# Altium schematic sheet fpga_io.schdoc: FPGA IO
size 431 x 279 mm; DrawnBy: D. Bruey, M.Ciuffo; Organization: Synapse Product Development, LLC.; Address1: 1511 6th Ave., Suite 400; Address2: Seattle, Washington 98101; Address3: 206.381.0898; Address4: www.synapse.com; DocumentNumber: 5; SheetNumber: 3; SheetTotal: 10; PageSetup: Record=PageOptions|CenterHorizontal=True|CenterVertical=True|PrintScale=1.06|XCorrection=1.00|YCorrection=1.00|PrintKind=1|BorderSize=5000000|LeftOffset=0|BottomOffset=0|Orientation=2|PaperLength=4318|PaperWidth=2794|Scale=100|PaperSource=7|PrintQuality=200|MediaType=1|DitherType=10|PrintScaleMode=1|PaperKind=11x17|PaperIndex=3
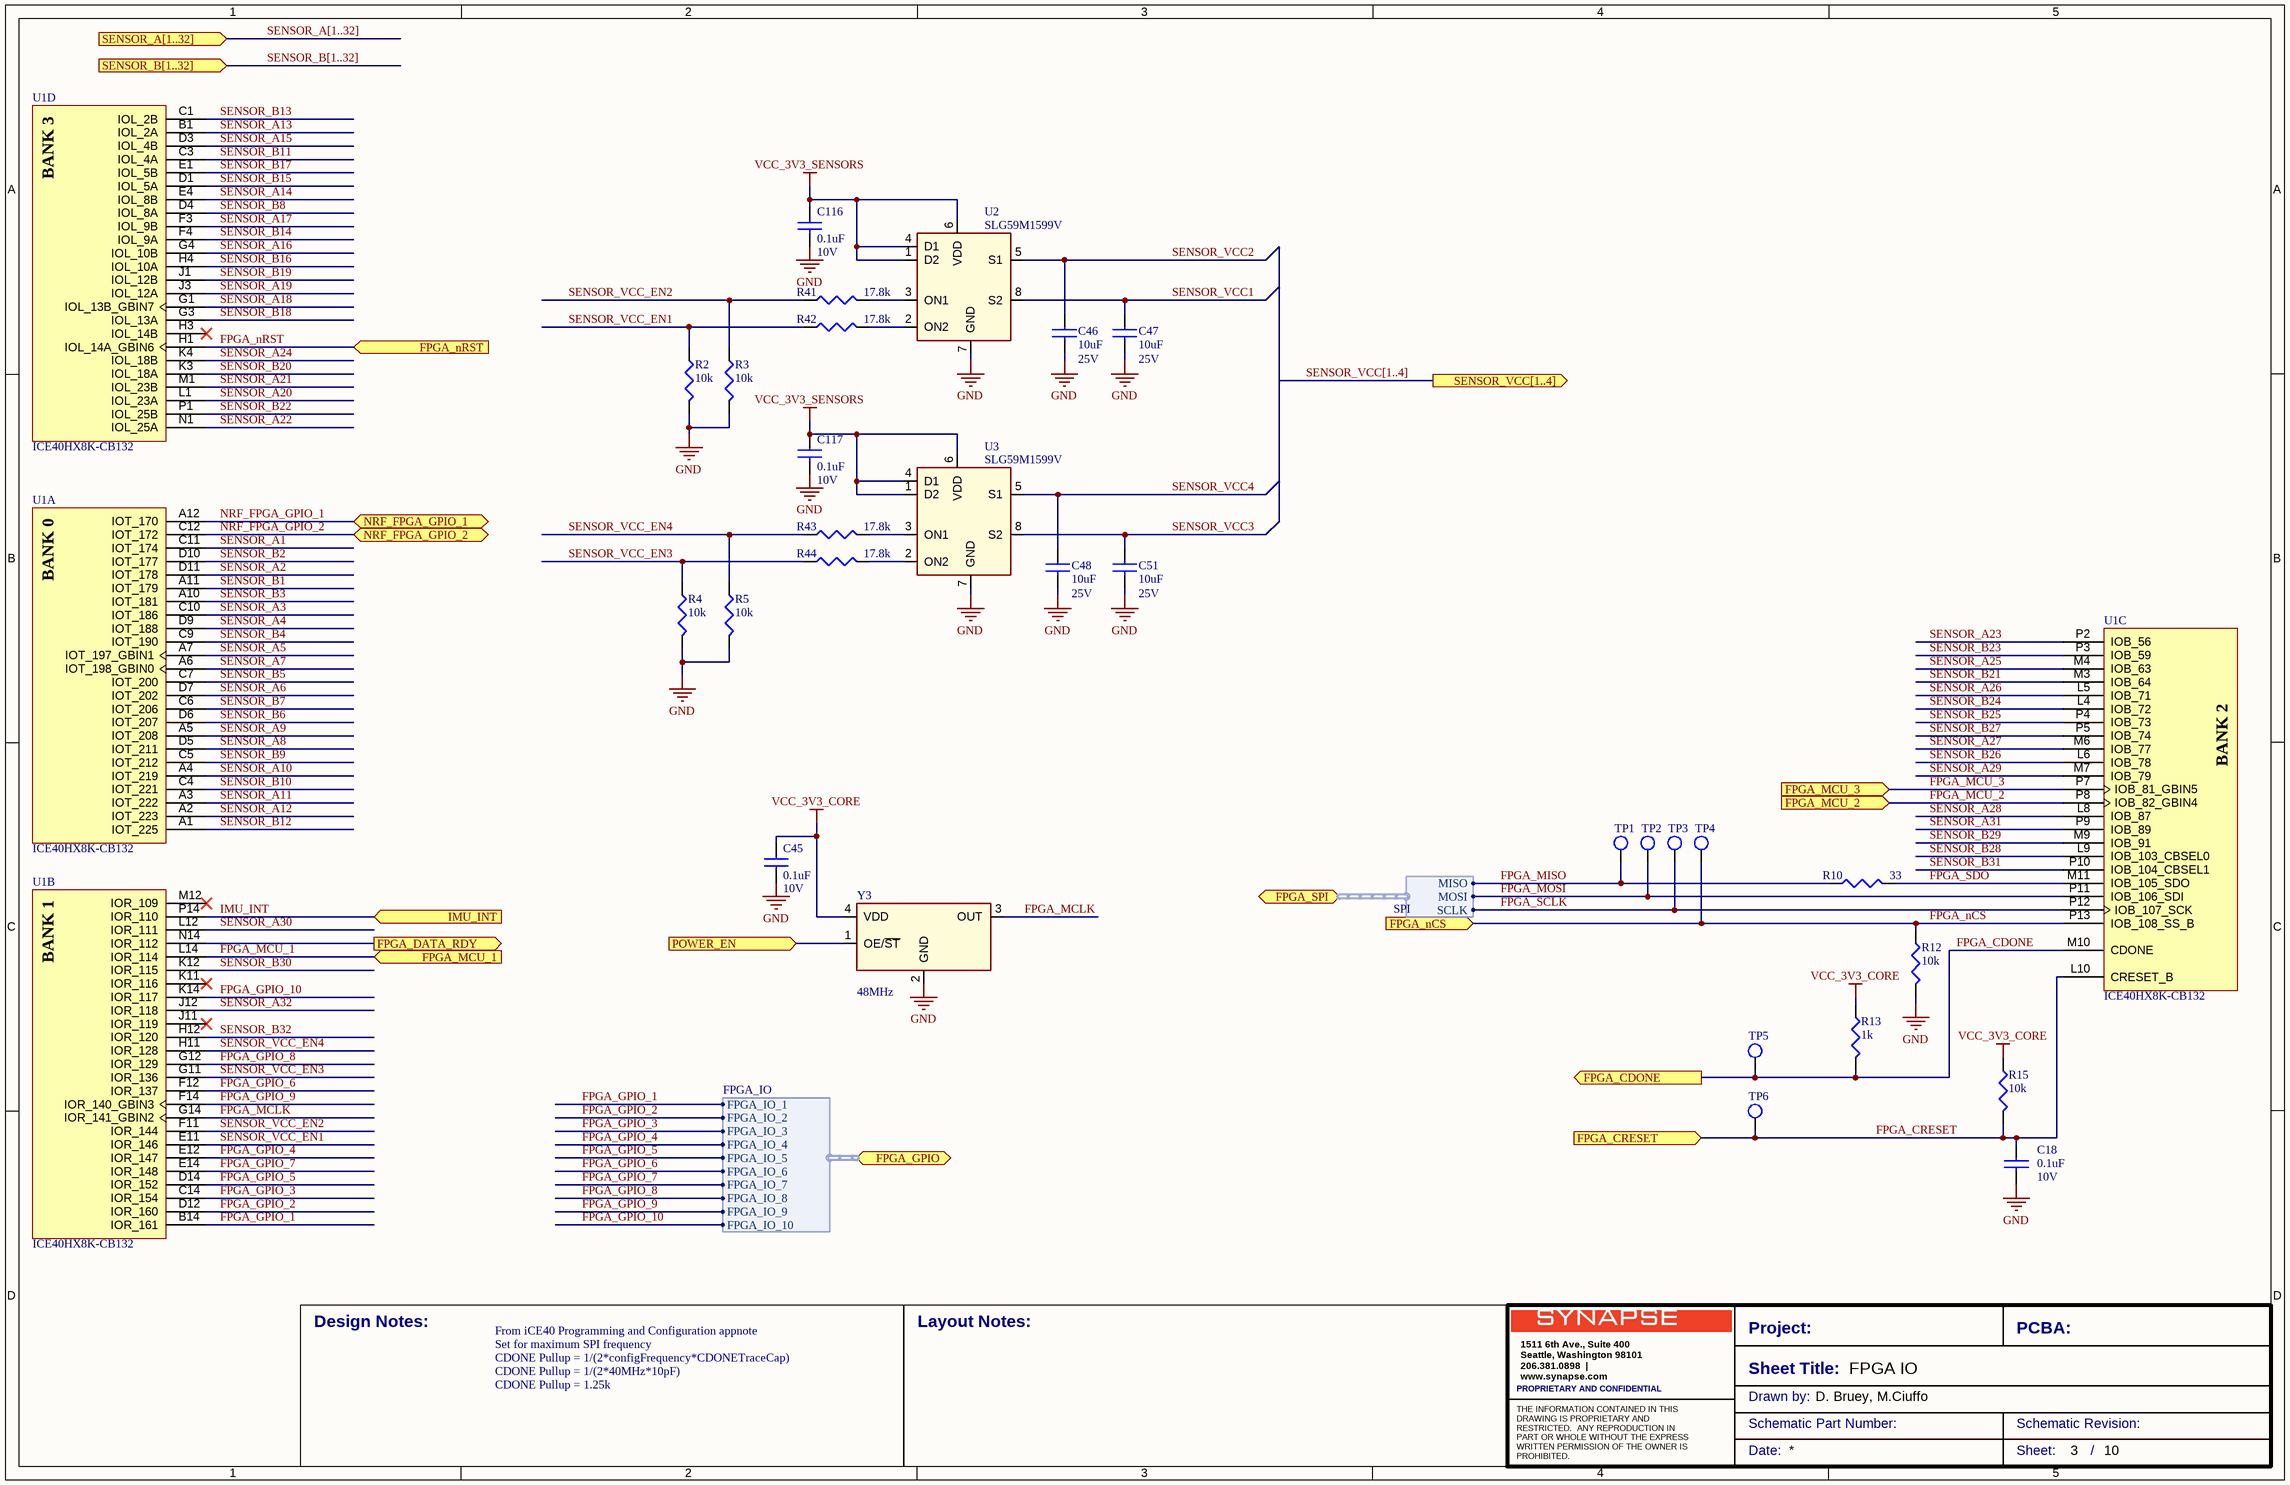
[diagram p0: fpga_io.schdoc]

## Parts
C18  0.1uF  Voltage: 10V  [0201-IPCsm_33]
C45  0.1uF  Voltage: 10V  [0201-IPCsm_33]
C46  10uF  Voltage: 25V  [0603-ipcsm_90]
C47  10uF  Voltage: 25V  [0603-ipcsm_90]
C48  10uF  Voltage: 25V  [0603-ipcsm_90]
C51  10uF  Voltage: 25V  [0603-ipcsm_90]
C116  0.1uF  Voltage: 10V  [0201-IPCsm_33]
C117  0.1uF  Voltage: 10V  [0201-IPCsm_33]
R2  10k  [0201-IPCsm_26]
R3  10k  [0201-IPCsm_26]
R4  10k  [0201-IPCsm_26]
R5  10k  [0201-IPCsm_26]
R10  33  [0201-IPCsm_26]
R12  10k  [0201-IPCsm_26]
R13  1k  [0201-IPCsm_26]
R15  10k  [0201-IPCsm_26]
R41  17.8k  [0201-IPCsm_26]
R42  17.8k  [0201-IPCsm_26]
R43  17.8k  [0201-IPCsm_26]
R44  17.8k  [0201-IPCsm_26]
TP1  tp-1mm  [TP-S100_SMT]  (value not drawn)  (no BOM)
TP2  tp-1mm  [TP-S100_SMT]  (value not drawn)  (no BOM)
TP3  tp-1mm  [TP-S100_SMT]  (value not drawn)  (no BOM)
TP4  tp-1mm  [TP-S100_SMT]  (value not drawn)  (no BOM)
TP5  tp-1mm  [TP-S100_SMT]  (value not drawn)  (no BOM)
TP6  tp-1mm  [TP-S100_SMT]  (value not drawn)  (no BOM)
U1  ICE40HX8K-CB132  [LATC-csBGA-132]  (parts A,B,C,D of 5)
U2  SLG59M1599V  [STDFN8_SLG59M1599V]
U3  SLG59M1599V  [STDFN8_SLG59M1599V]
Y3  48MHz  [XTAL_SiT1602_250x200x80]

## Ports
FPGA_CDONE (out), FPGA_CRESET (in), FPGA_DATA_RDY (out), FPGA_GPIO (harness FPGA_IO), FPGA_MCU_1 (in), FPGA_MCU_2 (in), FPGA_MCU_3 (in), FPGA_nCS (in), FPGA_nRST (in), FPGA_SPI (harness SPI), IMU_INT (in), NRF_FPGA_GPIO_1 (bidir), NRF_FPGA_GPIO_2 (bidir), POWER_EN (in), SENSOR_A[1..32] (in), SENSOR_B[1..32] (in), SENSOR_VCC[1..4] (out)

## Harnesses
SPI: MOSI, MISO, SCLK
FPGA_IO: FPGA_IO_2, FPGA_IO_3, FPGA_IO_4, FPGA_IO_5, FPGA_IO_6, FPGA_IO_7, FPGA_IO_8, FPGA_IO_9, FPGA_IO_10, FPGA_IO_1

## Nets
GND: C18.2 C45.2 C46.2 C47.2 C48.2 C51.2 C116.2 C117.2 R2.2 R3.2 R4.2 R5.2 R12.2 U2.7(GND) U3.7(GND) Y3.2(GND)
VCC_3V3_CORE: C45.1 R13.1 R15.1 Y3.4(VDD)
VCC_3V3_SENSORS: C116.1 C117.1 U2.1(D2) U2.4(D1) U2.6(VDD) U3.1(D2) U3.4(D1) U3.6(VDD)
FPGA_CDONE: R13.2 TP5.1(TP) U1.M10(CDONE) ; port FPGA_CDONE
FPGA_CRESET: C18.1 R15.2 TP6.1(TP) U1.L10(CRESET_B) ; port FPGA_CRESET
FPGA_DATA_RDY: U1.N14(IOR_112) ; port FPGA_DATA_RDY
FPGA_GPIO_1: U1.B14(IOR_161) ; port FPGA_GPIO.FPGA_IO_1
FPGA_GPIO_2: U1.D12(IOR_160) ; port FPGA_GPIO.FPGA_IO_2
FPGA_GPIO_3: U1.C14(IOR_154) ; port FPGA_GPIO.FPGA_IO_3
FPGA_GPIO_4: U1.E12(IOR_147) ; port FPGA_GPIO.FPGA_IO_4
FPGA_GPIO_5: U1.D14(IOR_152) ; port FPGA_GPIO.FPGA_IO_5
FPGA_GPIO_6: U1.F12(IOR_137) ; port FPGA_GPIO.FPGA_IO_6
FPGA_GPIO_7: U1.E14(IOR_148) ; port FPGA_GPIO.FPGA_IO_7
FPGA_GPIO_8: U1.G12(IOR_129) ; port FPGA_GPIO.FPGA_IO_8
FPGA_GPIO_9: U1.F14(IOR_140_GBIN3) ; port FPGA_GPIO.FPGA_IO_9
FPGA_GPIO_10: U1.K14(IOR_117) ; port FPGA_GPIO.FPGA_IO_10
FPGA_MCLK: U1.G14(IOR_141_GBIN2) Y3.3(OUT)
FPGA_MCU_1: U1.L14(IOR_114) ; port FPGA_MCU_1
FPGA_MCU_2: U1.P8(IOB_82_GBIN4) ; port FPGA_MCU_2
FPGA_MCU_3: U1.P7(IOB_81_GBIN5) ; port FPGA_MCU_3
FPGA_MISO: R10.1 TP1.1(TP) ; port FPGA_SPI.MISO
FPGA_MOSI: TP2.1(TP) U1.P11(IOB_106_SDI) ; port FPGA_SPI.MOSI
FPGA_nCS: R12.1 TP4.1(TP) U1.P13(IOB_108_SS_B) ; port FPGA_nCS
FPGA_nRST: U1.H1(IOL_14A_GBIN6) ; port FPGA_nRST
FPGA_SCLK: TP3.1(TP) U1.P12(IOB_107_SCK) ; port FPGA_SPI.SCLK
FPGA_SDO: R10.2 U1.M11(IOB_105_SDO)
IMU_INT: U1.P14(IOR_110) ; port IMU_INT
NRF_FPGA_GPIO_1: U1.A12(IOT_170) ; port NRF_FPGA_GPIO_1
NRF_FPGA_GPIO_2: U1.C12(IOT_172) ; port NRF_FPGA_GPIO_2
POWER_EN: Y3.1(OE/~{ST}) ; port POWER_EN
SENSOR_A1: U1.C11(IOT_174)
SENSOR_A2: U1.D11(IOT_178)
SENSOR_A3: U1.C10(IOT_186)
SENSOR_A4: U1.D9(IOT_188)
SENSOR_A5: U1.A7(IOT_197_GBIN1)
SENSOR_A6: U1.D7(IOT_202)
SENSOR_A7: U1.A6(IOT_198_GBIN0)
SENSOR_A8: U1.D5(IOT_211)
SENSOR_A9: U1.A5(IOT_208)
SENSOR_A10: U1.A4(IOT_219)
SENSOR_A11: U1.A3(IOT_222)
SENSOR_A12: U1.A2(IOT_223)
SENSOR_A13: U1.B1(IOL_2A)
SENSOR_A14: U1.E4(IOL_8B)
SENSOR_A15: U1.D3(IOL_4B)
SENSOR_A16: U1.G4(IOL_10B)
SENSOR_A17: U1.F3(IOL_9B)
SENSOR_A18: U1.G1(IOL_13B_GBIN7)
SENSOR_A19: U1.J3(IOL_12A)
SENSOR_A20: U1.L1(IOL_23A)
SENSOR_A21: U1.M1(IOL_23B)
SENSOR_A22: U1.N1(IOL_25A)
SENSOR_A23: U1.P2(IOB_56)
SENSOR_A24: U1.K4(IOL_18B)
SENSOR_A25: U1.M4(IOB_63)
SENSOR_A26: U1.L5(IOB_71)
SENSOR_A27: U1.M6(IOB_77)
SENSOR_A28: U1.L8(IOB_87)
SENSOR_A29: U1.M7(IOB_79)
SENSOR_A30: U1.L12(IOR_111)
SENSOR_A31: U1.P9(IOB_89)
SENSOR_A32: U1.J12(IOR_118)
SENSOR_B1: U1.A11(IOT_179)
SENSOR_B2: U1.D10(IOT_177)
SENSOR_B3: U1.A10(IOT_181)
SENSOR_B4: U1.C9(IOT_190)
SENSOR_B5: U1.C7(IOT_200)
SENSOR_B6: U1.D6(IOT_207)
SENSOR_B7: U1.C6(IOT_206)
SENSOR_B8: U1.D4(IOL_8A)
SENSOR_B9: U1.C5(IOT_212)
SENSOR_B10: U1.C4(IOT_221)
SENSOR_B11: U1.C3(IOL_4A)
SENSOR_B12: U1.A1(IOT_225)
SENSOR_B13: U1.C1(IOL_2B)
SENSOR_B14: U1.F4(IOL_9A)
SENSOR_B15: U1.D1(IOL_5A)
SENSOR_B16: U1.H4(IOL_10A)
SENSOR_B17: U1.E1(IOL_5B)
SENSOR_B18: U1.G3(IOL_13A)
SENSOR_B19: U1.J1(IOL_12B)
SENSOR_B20: U1.K3(IOL_18A)
SENSOR_B21: U1.M3(IOB_64)
SENSOR_B22: U1.P1(IOL_25B)
SENSOR_B23: U1.P3(IOB_59)
SENSOR_B24: U1.L4(IOB_72)
SENSOR_B25: U1.P4(IOB_73)
SENSOR_B26: U1.L6(IOB_78)
SENSOR_B27: U1.P5(IOB_74)
SENSOR_B28: U1.L9(IOB_103_CBSEL0)
SENSOR_B29: U1.M9(IOB_91)
SENSOR_B30: U1.K12(IOR_115)
SENSOR_B31: U1.P10(IOB_104_CBSEL1)
SENSOR_B32: U1.H12(IOR_120)
SENSOR_VCC1: C47.1 U2.8(S2)
SENSOR_VCC2: C46.1 U2.5(S1)
SENSOR_VCC3: C51.1 U3.8(S2)
SENSOR_VCC4: C48.1 U3.5(S1)
SENSOR_VCC_EN1: R2.1 R42.1 U1.E11(IOR_146)
SENSOR_VCC_EN2: R3.1 R41.1 U1.F11(IOR_144)
SENSOR_VCC_EN3: R4.1 R44.1 U1.G11(IOR_136)
SENSOR_VCC_EN4: R5.1 R43.1 U1.H11(IOR_128)
NetR41_2: R41.2 U2.3(ON1)
NetR42_2: R42.2 U2.2(ON2)
NetR43_2: R43.2 U3.3(ON1)
NetR44_2: R44.2 U3.2(ON2)

Not connected (* = marked no-connect by the designer): U1 H3(IOL_14B)* J11(IOR_119)* K11(IOR_116)* M12(IOR_109)*

## Buses and harness runs
bus SENSOR_A[1..32] = port SENSOR_A[1..32]
bus SENSOR_B[1..32] = port SENSOR_B[1..32]
bus SENSOR_VCC[1..4] = port SENSOR_VCC[1..4]

## Notes on the sheet
- CDONE Pullup = 1/(2*configFrequency*CDONETraceCap)
- CDONE Pullup = 1/(2*40MHz*10pF)
- From iCE40 Programming and Configuration appnote
- Set for maximum SPI frequency
- CDONE Pullup = 1.25k
- Design Notes:
- Layout Notes:
- Project:
- Sheet Title:
- PCBA:
- PROPRIETARY AND CONFIDENTIAL
- Drawn by:
- Schematic Part Number:
- Schematic Revision:
- Date:
- Sheet:
- /
- (in symbol ICE40HX8K-CB132, part A) BANK 0
- (in symbol ICE40HX8K-CB132, part B) BANK 1
- (in symbol ICE40HX8K-CB132, part C) BANK 2
- (in symbol ICE40HX8K-CB132, part D) BANK 3

## Library data of the parts
C18 C45 C116 C117 = CL03A104KP3NNNC: CAP CER 0.1UF 10V 10% X5R 0201; part_type: capacitor; id: 1260; mfg: Samsung Electro-Mechanics America, Inc; dist: DIGIKEY; dist_pn: 1276-1115-2-ND; source_package: C_1U_10V_X5R_0201; TableName: viewAltiumCapacitors; mfg_pn: CL03A104KP3NNNC; type: X5R; tolerance: 10%; height: 0.33mm; status: Unknown
C46-C48 C51 = CL10A106MA8NRNC: CAP CER 10UF 25V 20% X5R 0603; part_type: capacitor; id: 1157; mfg: Samsung Electro-Mechanics America, Inc; dist: Digikey; dist_pn: 1276-1869-1-ND; TableName: viewAltiumCapacitors; mfg_pn: CL10A106MA8NRNC; type: X5R; tolerance: 20%; height: 0.9MM; status: Unknown
R2-R5 R12 R15 = RC0201FR-0710KL: RES 10K OHM 1/20W 1% 0201 SMD; part_type: resistor; Tolerance: 1.00%; Voltage: 50V; DIST: DIGIKEY; MFG: YAGEO; DIST_PN: 311-10.0KMCT-ND; Power: 0.05W; id: 1527; source_package: R_10k_0201_1P; TableName: viewAltiumResistors; Height: .26MM; MFG_PN: RC0201FR-0710KL; status: Unknown
R10 = RC0201FR-0733R: RES 33 OHM 1/20W 1% 0201 SMD; part_type: resistor; Tolerance: 1.00%; Voltage: 50V; DIST: DIGIKEY; MFG: YAGEO; DIST_PN: 311-33.0MCT-ND; Power: 0.05W; id: 1544; source_package: R_33_0201_1P; TableName: viewAltiumResistors; Height: .26MM; MFG_PN: RC0201FR-0733R; status: Unknown
R13 = ERJ-1GEF1001C: RES 1.00K OHM 1/20W 1% 0201 SMD; part_type: resistor; Tolerance: 1.00%; Voltage: 15V; DIST: Digikey; MFG: Panasonic; DIST_PN: P1.00KABDKR-ND; Power: 0.05W; id: 1100; source_package: R_1k_1p_0201; TableName: viewAltiumResistors; Height: 0.26MM; MFG_PN: ERJ-1GEF1001C; status: Unknown
R41-R44 = ERJ-1GEF1782C: RES SMD 17.8K OHM 1% 1/20W 0201; part_type: resistor; Tolerance: 1.00%; DIST: DIGIKEY; MFG: PANASONIC; DIST_PN: P17.8KABCT-ND; Power: 0.05W; id: 2379; TableName: viewAltiumResistors; Height: 0.26MM; MFG_PN: ERJ-1GEF1782C; status: Unknown
TP1-TP6 = TP0042: TESTPOINT, 1MM SMD, Square pad, Round SM opening; part_type: test_point; mfg_pn: TP0042; mfg: NA; id: 888; TableName: viewAltiumMisc; dist: NA; dist_pn: NA; source_package: tp_smt; status: Unknown
U1 = ICE40HX8K-CB132: IC FPGA 95 I/O 132CBGA; id: 2469; mfg: Lattice Semiconductor Corporation; dist: Digikey; dist_pn: 220-1577-ND; source_package: ICE40HX8K_CB132; voltage: 1.2-3.3v; TableName: viewAltiumIcs; mfg_pn: ICE40HX8K-CB132; part_type: ic; height: 1mm; status: Unknown
U2 U3 = SLG59M1599V: Dual 40mohm 1A Load Switch; part_type: ic; id: 2416; mfg: Silego; voltage: 2.5-5.5V; TableName: viewAltiumIcs; mfg_pn: SLG59M1599V; dist: Silego; dist_pn: SLG59M1599V; source_package: SLG59M1599V; height: .55mm; status: Good
Y3 = SIT1602AI-12-33E-48.000000G: OSC MEMS 48.000MHZ H/LV-CMOS SMD; id: 1179; mfg: SiTime; dist: DigiKey; dist_pn: 1473-1062-1-ND; voltage: 3.3V; tolerance: 25ppm; TableName: viewAltiumMisc; mfg_pn: SIT1602AI-12-33E-48.000000G; part_type: osc; type: MEMs; height: 0.8mm; status: Obsolete